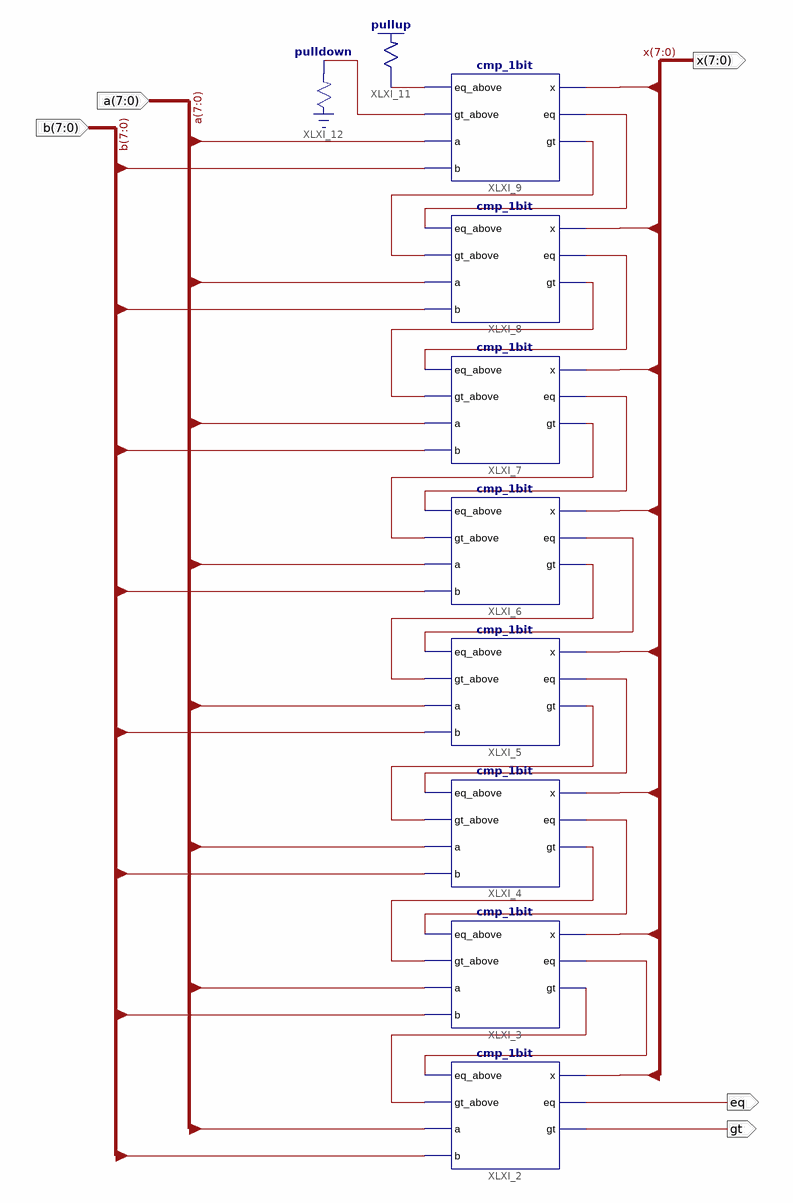
[diagram p0: schematic sheet 1]
// Xilinx ISE schematic cmp_8bit.sch (aspartan6) as structural Verilog: 10 symbols, 5 ports
module cmp_8bit (
  input  [7:0] a,
  input  [7:0] b,
  output [7:0] x,
  output eq,
  output gt
);

  wire XLXN_42, XLXN_43, XLXN_44, XLXN_45, XLXN_46, XLXN_47, XLXN_48, XLXN_51, XLXN_52, XLXN_53, XLXN_54,
       XLXN_55, XLXN_56, XLXN_57, XLXN_58, XLXN_59;

  cmp_1bit XLXI_2 (.a(a[7]), .b(b[7]), .eq(eq), .eq_above(XLXN_42), .gt(gt), .gt_above(XLXN_43), .x(x[7]));
  cmp_1bit XLXI_3 (.a(a[6]), .b(b[6]), .eq(XLXN_42), .eq_above(XLXN_44), .gt(XLXN_43), .gt_above(XLXN_45), .x(x[6]));
  cmp_1bit XLXI_4 (.a(a[5]), .b(b[5]), .eq(XLXN_44), .eq_above(XLXN_46), .gt(XLXN_45), .gt_above(XLXN_47), .x(x[5]));
  cmp_1bit XLXI_5 (.a(a[4]), .b(b[4]), .eq(XLXN_46), .eq_above(XLXN_52), .gt(XLXN_47), .gt_above(XLXN_53), .x(x[4]));
  cmp_1bit XLXI_6 (.a(a[3]), .b(b[3]), .eq(XLXN_52), .eq_above(XLXN_48), .gt(XLXN_53), .gt_above(XLXN_51), .x(x[3]));
  cmp_1bit XLXI_7 (.a(a[2]), .b(b[2]), .eq(XLXN_48), .eq_above(XLXN_54), .gt(XLXN_51), .gt_above(XLXN_55), .x(x[2]));
  cmp_1bit XLXI_8 (.a(a[1]), .b(b[1]), .eq(XLXN_54), .eq_above(XLXN_56), .gt(XLXN_55), .gt_above(XLXN_57), .x(x[1]));
  cmp_1bit XLXI_9 (.a(a[0]), .b(b[0]), .eq(XLXN_56), .eq_above(XLXN_58), .gt(XLXN_57), .gt_above(XLXN_59), .x(x[0]));
  \pullup  XLXI_11 (.O(XLXN_58));
  \pulldown  XLXI_12 (.O(XLXN_59));
endmodule
